# Altium project PCB_IOT_VER.1.PrjPcb
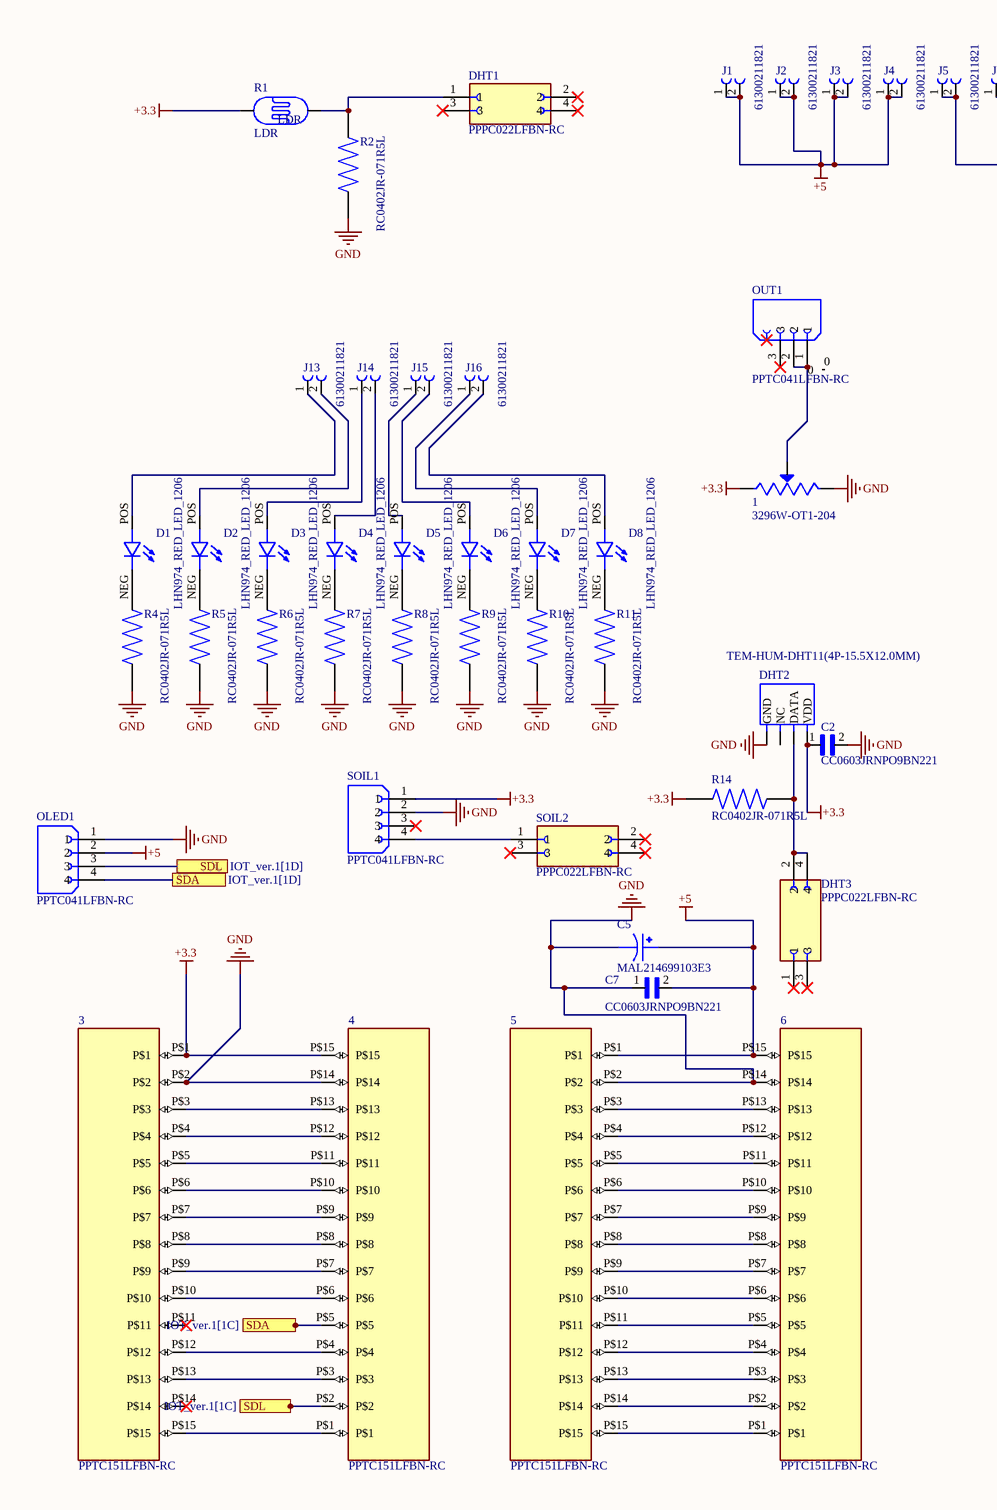
[diagram p0: IOT_ver.1.SchDoc, left]
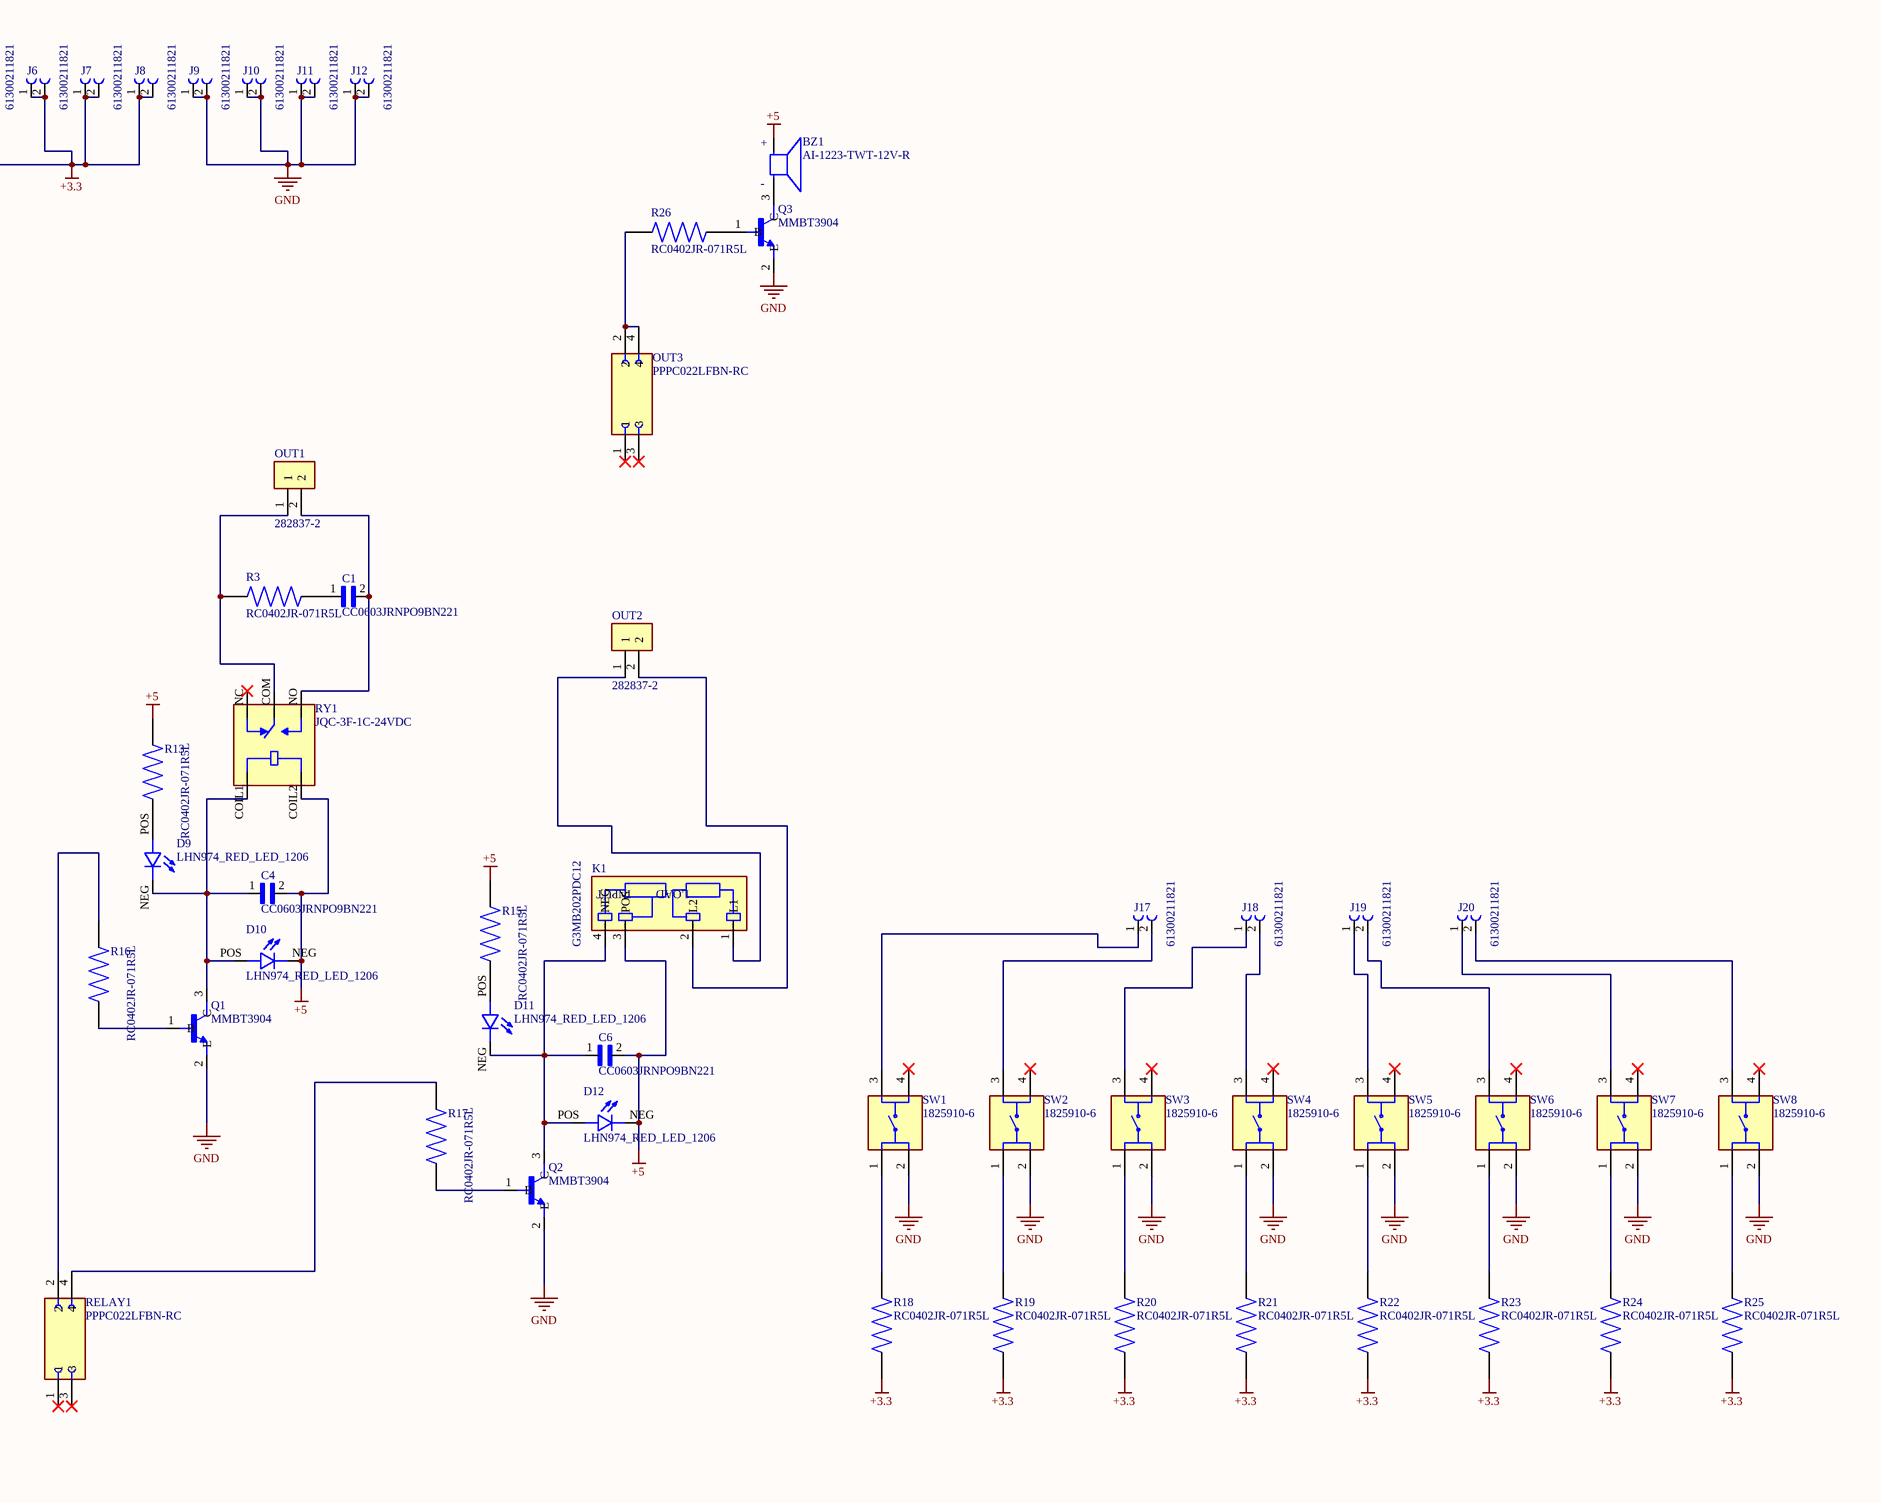
[diagram p1: IOT_ver.1.SchDoc, right]
1 sheet, 93 parts. Net scope: flat (ports and power ports of the same name join across sheets).
Board file: PCB_IOT_VER.1.1.1.PcbDoc

## Sheet IOT_ver.1.SchDoc
size 699 x 299 mm; SheetNumber: 1; SheetTotal: 1

### Parts
(Parts that share a designator on the sheet are numbered #1, #2 ... from top to bottom, then left to right.)
1  3296W-OT1-204  [TRIM_3296W-OT1-204]
3  PPTC151LFBN-RC  [PPTC151LFBN-RC]
4  PPTC151LFBN-RC  [PPTC151LFBN-RC]
5  PPTC151LFBN-RC  [PPTC151LFBN-RC]
6  PPTC151LFBN-RC  [PPTC151LFBN-RC]
BZ1  AI-1223-TWT-12V-R  [XDCR_AI-1223-TWT-12V-R]
C1  CC0603JRNPO9BN221  [C_0.1/250V]
C2  CC0603JRNPO9BN221  [0805-C]
C4  CC0603JRNPO9BN221  [0805-C]
C5  MAL214699103E3  [CAPAE1050X1050N]
C6  CC0603JRNPO9BN221  [0805-C]
C7  CC0603JRNPO9BN221  [0805-C]
D1  LHN974_RED_LED_1206  [LEDC3216X120N]
D2  LHN974_RED_LED_1206  [LEDC3216X120N]
D3  LHN974_RED_LED_1206  [LEDC3216X120N]
D4  LHN974_RED_LED_1206  [LEDC3216X120N]
D5  LHN974_RED_LED_1206  [LEDC3216X120N]
D6  LHN974_RED_LED_1206  [LEDC3216X120N]
D7  LHN974_RED_LED_1206  [LEDC3216X120N]
D8  LHN974_RED_LED_1206  [LEDC3216X120N]
D9  LHN974_RED_LED_1206  [LEDC3216X120N]
D10  LHN974_RED_LED_1206  [LEDC3216X120N]
D11  LHN974_RED_LED_1206  [LEDC3216X120N]
D12  LHN974_RED_LED_1206  [LEDC3216X120N]
DHT1  PPPC022LFBN-RC  [SULLINS_PPPC022LFBN-RC]
DHT2  TEM-HUM-DHT11(4P-15.5X12.0MM)  [SNR4-2.54-15.5X12.0X5.5MM]
DHT3  PPPC022LFBN-RC  [SULLINS_PPPC022LFBN-RC]
J1  61300211821  [61300211821]
J2  61300211821  [61300211821]
J3  61300211821  [61300211821]
J4  61300211821  [61300211821]
J5  61300211821  [61300211821]
J6  61300211821  [61300211821]
J7  61300211821  [61300211821]
J8  61300211821  [61300211821]
J9  61300211821  [61300211821]
J10  61300211821  [61300211821]
J11  61300211821  [61300211821]
J12  61300211821  [61300211821]
J13  61300211821  [61300211821]
J14  61300211821  [61300211821]
J15  61300211821  [61300211821]
J16  61300211821  [61300211821]
J17  61300211821  [61300211821]
J18  61300211821  [61300211821]
J19  61300211821  [61300211821]
J20  61300211821  [61300211821]
K1  G3MB202PDC12  [RELAY_G3MB202PDC12]
OLED1  PPTC041LFBN-RC  [SULLINS_PPTC041LFBN-RC]
OUT1#1  PPTC041LFBN-RC  [SULLINS_PPTC041LFBN-RC]
OUT1#2  282837-2  [TE_282837-2]
OUT2  282837-2  [TE_282837-2]
OUT3  PPPC022LFBN-RC  [SULLINS_PPPC022LFBN-RC]
Q1  MMBT3904  [SOT95P240X120-3N]
Q2  MMBT3904  [SOT95P240X120-3N]
Q3  MMBT3904  [SOT95P240X120-3N]
R1  LDR  [LDR]
R2  RC0402JR-071R5L  [RESC1005X40N]
R3  RC0402JR-071R5L  [2512-R]
R4  RC0402JR-071R5L  [0805-R]
R5  RC0402JR-071R5L  [0805-R]
R6  RC0402JR-071R5L  [0805-R]
R7  RC0402JR-071R5L  [0805-R]
R8  RC0402JR-071R5L  [0805-R]
R9  RC0402JR-071R5L  [0805-R]
R10  RC0402JR-071R5L  [0805-R]
R11  RC0402JR-071R5L  [0805-R]
R13  RC0402JR-071R5L  [0805-R]
R14  RC0402JR-071R5L  [0805-R]
R15  RC0402JR-071R5L  [0805-R]
R16  RC0402JR-071R5L  [0805-R]
R17  RC0402JR-071R5L  [0805-R]
R18  RC0402JR-071R5L  [RESC1005X40N]
R19  RC0402JR-071R5L  [RESC1005X40N]
R20  RC0402JR-071R5L  [RESC1005X40N]
R21  RC0402JR-071R5L  [RESC1005X40N]
R22  RC0402JR-071R5L  [RESC1005X40N]
R23  RC0402JR-071R5L  [RESC1005X40N]
R24  RC0402JR-071R5L  [RESC1005X40N]
R25  RC0402JR-071R5L  [RESC1005X40N]
R26  RC0402JR-071R5L  [0805-R]
RELAY1  PPPC022LFBN-RC  [SULLINS_PPPC022LFBN-RC]
RY1  JQC-3F-1C-24VDC  [RELAY_JQC-3F-1C-24VDC]
SOIL1  PPTC041LFBN-RC  [SULLINS_PPTC041LFBN-RC]
SOIL2  PPPC022LFBN-RC  [SULLINS_PPPC022LFBN-RC]
SW1  1825910-6  [SW_1825910-6-4]
SW2  1825910-6  [SW_1825910-6-4]
SW3  1825910-6  [SW_1825910-6-4]
SW4  1825910-6  [SW_1825910-6-4]
SW5  1825910-6  [SW_1825910-6-4]
SW6  1825910-6  [SW_1825910-6-4]
SW7  1825910-6  [SW_1825910-6-4]
SW8  1825910-6  [SW_1825910-6-4]

### Ports
SDA (see IOT_ver.1[1C]), SDA (see IOT_ver.1[1D]), SDL (see IOT_ver.1[1C]), SDL (see IOT_ver.1[1D])

### Nets
+3.3: 1.1(CCW) 3.P$1 4.P$15 C2.1 DHT2.1(VDD) J5.1 J5.2 J6.1 J6.2 J7.1 J7.2 J8.1 J8.2 R1.1(P$1) R14.2 R18.1 R19.1 R20.1 R21.1 R22.1 R23.1 R24.1 R25.1 SOIL1.1
+5: 5.P$1 6.P$15 BZ1.P(POS) C4.2 C5.1 C6.2 C7.2 D10.NEG D12.NEG J1.1 J1.2 J2.1 J2.2 J3.1 J3.2 J4.1 J4.2 K1.3(POS) OLED1.2 R13.2 R15.2 RY1.COIL2
GND: 1.3(CW) 3.P$2 4.P$14 5.P$2 6.P$14 C2.2 C5.2 C7.1 DHT2.4(GND) J9.1 J9.2 J10.1 J10.2 J11.1 J11.2 J12.1 J12.2 OLED1.1 Q1.2(E) Q2.2(E) Q3.2(E) R2.1 R4.1 R5.1 R6.1 R7.1 R8.1 R9.1 R10.1 R11.1 SOIL1.2 SW1.2 SW2.2 SW3.2 SW4.2 SW5.2 SW6.2 SW7.2 SW8.2
Net1_2: 1.2(WIPER) OUT1#1.1 OUT1#1.2
Net3_P$3: 3.P$3 4.P$13
Net3_P$4: 3.P$4 4.P$12
Net3_P$5: 3.P$5 4.P$11
Net3_P$6: 3.P$6 4.P$10
Net3_P$7: 3.P$7 4.P$9
Net3_P$8: 3.P$8 4.P$8
Net3_P$9: 3.P$9 4.P$7
Net3_P$10: 3.P$10 4.P$6
Net3_P$12: 3.P$12 4.P$4
Net3_P$13: 3.P$13 4.P$3
Net3_P$15: 3.P$15 4.P$1
Net4_P$2: 4.P$2 OLED1.3 ; port SDL
Net4_P$5: 4.P$5 OLED1.4 ; port SDA
Net5_P$3: 5.P$3 6.P$13
Net5_P$4: 5.P$4 6.P$12
Net5_P$5: 5.P$5 6.P$11
Net5_P$6: 5.P$6 6.P$10
Net5_P$7: 5.P$7 6.P$9
Net5_P$8: 5.P$8 6.P$8
Net5_P$9: 5.P$9 6.P$7
Net5_P$10: 5.P$10 6.P$6
Net5_P$11: 5.P$11 6.P$5
Net5_P$12: 5.P$12 6.P$4
Net5_P$13: 5.P$13 6.P$3
Net5_P$14: 5.P$14 6.P$2
Net5_P$15: 5.P$15 6.P$1
NetBZ1_N: BZ1.N(NEG) Q3.3(C)
NetC1_1: C1.1 R3.1
NetC1_2: C1.2 OUT1#2.2 RY1.NO
NetC4_1: C4.1 D9.NEG D10.POS Q1.3(C) RY1.COIL1
NetC6_1: C6.1 D11.NEG D12.POS K1.4(NEG) Q2.3(C)
NetD1_NEG: D1.NEG R4.2
NetD1_POS: D1.POS J13.1
NetD2_NEG: D2.NEG R5.2
NetD2_POS: D2.POS J13.2
NetD3_NEG: D3.NEG R6.2
NetD3_POS: D3.POS J14.1
NetD4_NEG: D4.NEG R7.2
NetD4_POS: D4.POS J14.2
NetD5_NEG: D5.NEG R8.2
NetD5_POS: D5.POS J15.1
NetD6_NEG: D6.NEG R9.2
NetD6_POS: D6.POS J15.2
NetD7_NEG: D7.NEG R10.2
NetD7_POS: D7.POS J16.1
NetD8_NEG: D8.NEG R11.2
NetD8_POS: D8.POS J16.2
NetD9_POS: D9.POS R13.1
NetD11_POS: D11.POS R15.1
NetDHT1_1: DHT1.1 R1.2(P$2) R2.2
NetDHT2_2: DHT2.2(DATA) DHT3.2 DHT3.4 R14.1
NetJ17_1: J17.1 SW1.3
NetJ17_2: J17.2 SW2.3
NetJ18_1: J18.1 SW3.3
NetJ18_2: J18.2 SW4.3
NetJ19_1: J19.1 SW5.3
NetJ19_2: J19.2 SW6.3
NetJ20_1: J20.1 SW7.3
NetJ20_2: J20.2 SW8.3
NetK1_1: K1.1(L1) OUT2.1
NetK1_2: K1.2(L2) OUT2.2
NetOUT1#2_1: OUT1#2.1 R3.2 RY1.COM
NetOUT3_2: OUT3.2 OUT3.4 R26.2
NetQ1_1: Q1.1(B) R16.1
NetQ2_1: Q2.1(B) R17.1
NetQ3_1: Q3.1(B) R26.1
NetR16_2: R16.2 RELAY1.2
NetR17_2: R17.2 RELAY1.4
NetR18_2: R18.2 SW1.1
NetR19_2: R19.2 SW2.1
NetR20_2: R20.2 SW3.1
NetR21_2: R21.2 SW4.1
NetR22_2: R22.2 SW5.1
NetR23_2: R23.2 SW6.1
NetR24_2: R24.2 SW7.1
NetR25_2: R25.2 SW8.1
NetSOIL1_4: SOIL1.4 SOIL2.1

Not connected (* = marked no-connect by the designer): 3 P$11* P$14*; DHT1 2* 3* 4*; DHT2 3(NC); DHT3 1* 3*; OUT1#1 0 3*; OUT3 1* 3*; RELAY1 1* 3*; RY1 NC*; SOIL1 3*; SOIL2 2* 3* 4*; SW1 4*; SW2 4*; SW3 4*; SW4 4*; SW5 4*; SW6 4*; SW7 4*; SW8 4*

### Notes on the sheet
- (in symbol AI-1223-TWT-12V-R) +; -
- (in symbol G3MB202PDC12) INPUT; LOAD

### Library data of the parts
1 = 3296W-OT1-204: Potentiometers, multi, Resistors, trimmer, cermet, potentiometers, turn, sealed, Potentiometers and Accessories, Pass...; MF: Bourns; SnapEDA_Link: https://www.snapeda.com/parts/3296W-OT1-204/Bourns/view-part/?ref=snap; Package: SOT-23-5 Bourns; MP: 3296W-OT1-204; Check_prices: https://www.snapeda.com/parts/3296W-OT1-204/Bourns/view-part/?ref=eda; Price: None; Value: *; Availability: Not in stock
3-6 = PPTC151LFBN-RC: 15 Position Header Connector Through Hole; MF: Sullins Connector; Price: None; Availability: Unavailable; SnapEDA_Link: https://www.snapeda.com/parts/PPTC151LFBN-RC/Sullins%20Connector%20Solutions/view-part/592000/?ref=snap; Value: *; Package: None; MP: PPTC151LFBN-RC
BZ1 = AI-1223-TWT-12V-R: ELECTRO-MECHANICAL AUDIO INDICATOR; MF: PUI Audio,; SnapEDA_Link: https://www.snapeda.com/parts/AI-1223-TWT-12V-R/PUI+Audio%252C+Inc./view-part/?ref=snap; Package: None; MP: AI-1223-TWT-12V-R; Check_prices: https://www.snapeda.com/parts/AI-1223-TWT-12V-R/PUI+Audio%252C+Inc./view-part/?ref=eda; Purchase-URL: https://pricing.snapeda.com/search/part/AI-1223-TWT-12V-R/?ref=eda; Price: None; Value: *; Availability: In Stock
C1 = CC0603JRNPO9BN221: 220 pF Â±5% 50V Ceramic Capacitor C0G, NP0 0603 (1608 Metric); Value: 0.1 uf 250V; MF: Yageo; SnapEDA_Link: https://www.snapeda.com/parts/CC0603JRNPO9BN221/Yageo/view-part/?ref=snap; Purchase-URL: https://pricing.snapeda.com/search/part/CC0603JRNPO9BN221/?ref=eda; Availability: In Stock; Price: None; Package: 0603 Yageo; Check_prices: https://www.snapeda.com/parts/CC0603JRNPO9BN221/Yageo/view-part/?ref=eda; MP: CC0603JRNPO9BN221
C2 C4 C6 = CC0603JRNPO9BN221: 220 pF Â±5% 50V Ceramic Capacitor C0G, NP0 0603 (1608 Metric); Value: 0.1; MF: Yageo; SnapEDA_Link: https://www.snapeda.com/parts/CC0603JRNPO9BN221/Yageo/view-part/?ref=snap; Purchase-URL: https://pricing.snapeda.com/search/part/CC0603JRNPO9BN221/?ref=eda; Availability: In Stock; Price: None; Package: 0603 Yageo; Check_prices: https://www.snapeda.com/parts/CC0603JRNPO9BN221/Yageo/view-part/?ref=eda; MP: CC0603JRNPO9BN221
C5 = MAL214699103E3: 100ÂµF 50V Aluminum Electrolytic Capacitors Radial, Can - SMD 1500 Hrs @ 125Â°C; MF: Vishay BC; Value: 1000uF/16V; MP: MAL214699103E3; SnapEDA_Link: https://www.snapeda.com/parts/MAL214699103E3/Vishay%20BC%20Components/view-part/285948/?ref=snap; Digi-Key_Part_Number: 4437PHCT-ND; Mouser-Purchase-URL: https://snapeda.com/shop?store=Mouser&id=285948; DigiKey-Purchase-URL: https://snapeda.com/shop?store=DigiKey&id=285948; Package: Radial Vishay BC
C7 = CC0603JRNPO9BN221: 220 pF Â±5% 50V Ceramic Capacitor C0G, NP0 0603 (1608 Metric); Value: 0.1uF/16V; MF: Yageo; SnapEDA_Link: https://www.snapeda.com/parts/CC0603JRNPO9BN221/Yageo/view-part/?ref=snap; Purchase-URL: https://pricing.snapeda.com/search/part/CC0603JRNPO9BN221/?ref=eda; Availability: In Stock; Price: None; Package: 0603 Yageo; Check_prices: https://www.snapeda.com/parts/CC0603JRNPO9BN221/Yageo/view-part/?ref=eda; MP: CC0603JRNPO9BN221
D1-D12 = LHN974_RED_LED_1206: 2.6 V Red LED SMD; MP: LHN974 RED LED 1206; MF: Osram; SnapEDA_Link: https://www.snapeda.com/parts/LHN974%20RED%20LED%201206/Osram/view-part/7899607/?ref=snap; Availability: Not in stock; Price: None; Check_prices: https://www.snapeda.com/parts/LHN974%20RED%20LED%201206/Osram/view-part/7899607/?ref=eda; Value: *; Package: None
DHT1 DHT3 OUT3 RELAY1 SOIL2 = PPPC022LFBN-RC: 4 Position Header Connector 0.100 (2.54mm) Through Hole Gold; MF: Sullins Connector Solutions; Check_prices: https://www.snapeda.com/parts/PPPC022LFBN-RC/Sullins+Connector+Solutions/view-part/?ref=eda; Price: None; MP: PPPC022LFBN-RC; SnapEDA_Link: https://www.snapeda.com/parts/PPPC022LFBN-RC/Sullins+Connector+Solutions/view-part/?ref=snap; Availability: In Stock; Value: *; Purchase-URL: https://pricing.snapeda.com/search/part/PPPC022LFBN-RC/?ref=eda; Package: None
DHT2 = TEM-HUM-DHT11(4P-15.5X12.0MM): Servo AC 100 ~ 120VAC Supply 10A 120V Load; MP: DHT11; MF: Panasonic Industrial Automation Sales; Package: None; SnapEDA_Link: https://www.snapeda.com/parts/DHT11/Panasonic/view-part/6618018/?ref=snap; Check_prices: https://www.snapeda.com/parts/DHT11/Panasonic/view-part/6618018/?ref=eda; Availability: In Stock; Value: *; Price: None; Purchase-URL: https://pricing.snapeda.com/search/part/DHT11/?ref=eda
J1-J20 = 61300211821: Female header [WÃ¼rth Elektronik] 61300211821 Female header; MP: 61300211821; SnapEDA_Link: https://www.snapeda.com/parts/61300211821/W%C3%BCrth%20Elektronik/view-part/1736853/?ref=snap; Availability: Unavailable; Package: None; MF: WÃ¼rth Elektronik; Value: *; Price: None
K1 = G3MB202PDC12: Solid State SPST-NO (1 Form A) 4-SIP; MF: Omron Automation; MP: G3MB-202P-DC12; Value: *; Check_prices: https://www.snapeda.com/parts/G3MB-202P-DC12/Omron+Automation+and+Safety/view-part/?ref=eda; Price: None; SnapEDA_Link: https://www.snapeda.com/parts/G3MB-202P-DC12/Omron+Automation+and+Safety/view-part/?ref=snap; Availability: Not in stock; Package: None
OLED1 OUT1#1 SOIL1 = PPTC041LFBN-RC: 4 Position Header Connector 0.100 (2.54mm) Through Hole Tin; MF: Sullins Connector; Purchase-URL: https://pricing.snapeda.com/search/part/PPTC041LFBN-RC/?ref=eda; Check_prices: https://www.snapeda.com/parts/PPTC041LFBN-RC/Sullins+Connector+Solutions/view-part/?ref=eda; Package: None; SnapEDA_Link: https://www.snapeda.com/parts/PPTC041LFBN-RC/Sullins+Connector+Solutions/view-part/?ref=snap; Value: *; MP: PPTC041LFBN-RC; Digi-Key_Part_Number: S7002-ND
OUT1#2 OUT2 = 282837-2: Connector Terminal Blocks Receptacle 2 Position 5.08mm Solder Straight Thru-Hole 13.5A/Contact; MF: TE Connectivity; Check_prices: https://www.snapeda.com/parts/282837-2/TE+Connectivity+AMP+Connectors/view-part/?ref=eda; Value: *; Availability: In Stock; MP: 282837-2; Price: None; Package: None; SnapEDA_Link: https://www.snapeda.com/parts/282837-2/TE+Connectivity+AMP+Connectors/view-part/?ref=snap; Purchase-URL: https://pricing.snapeda.com/search/part/282837-2/?ref=eda
Q1-Q3 = MMBT3904: Bipolar _BJT_ Transistor NPN 40V 200mA 270MHz 350mW Surface Mount SOT-23-3; MF: STMicroelectronics; Price: None; Package: SOT-23-3 Taiwan Semiconductor; Value: *; MP: MMBT3904; Availability: Unavailable; SnapEDA_Link: https://www.snapeda.com/parts/MMBT3904/STMicroelectronics/view-part/2875870/?ref=snap
R1 = LDR: MF: Fairway Electronics; Value: *; Check_prices: https://www.snapeda.com/parts/LDR/Applied+Avionics/view-part/?ref=eda; Price: None; Package: None; SnapEDA_Link: https://www.snapeda.com/parts/LDR/Applied+Avionics/view-part/?ref=snap; Availability: In Stock; MP: LDR
R2 = RC0402JR-071R5L: 1.5 Ohms Â±5% 0.063W, 1/16W Chip Resistor 0402 (1005 Metric) Moisture Resistant Thick Film; Value: 10k; MF: Yageo; Check_prices: https://www.snapeda.com/parts/RC0402JR-071R5L/Yageo/view-part/?ref=eda; Availability: In Stock; MP: RC0402JR-071R5L; Price: None; Package: 1005 Panasonic Electronic Components; SnapEDA_Link: https://www.snapeda.com/parts/RC0402JR-071R5L/Yageo/view-part/?ref=snap; Purchase-URL: https://pricing.snapeda.com/search/part/RC0402JR-071R5L/?ref=eda
R3 = RC0402JR-071R5L: 1.5 Ohms Â±5% 0.063W, 1/16W Chip Resistor 0402 (1005 Metric) Moisture Resistant Thick Film; Value: 100; MF: Yageo; Check_prices: https://www.snapeda.com/parts/RC0402JR-071R5L/Yageo/view-part/?ref=eda; Availability: In Stock; MP: RC0402JR-071R5L; Price: None; Package: 1005 Panasonic Electronic Components; SnapEDA_Link: https://www.snapeda.com/parts/RC0402JR-071R5L/Yageo/view-part/?ref=snap; Purchase-URL: https://pricing.snapeda.com/search/part/RC0402JR-071R5L/?ref=eda
R4-R11 R13-R15 R18-R25 = RC0402JR-071R5L: 1.5 Ohms Â±5% 0.063W, 1/16W Chip Resistor 0402 (1005 Metric) Moisture Resistant Thick Film; Value: 1k; MF: Yageo; Check_prices: https://www.snapeda.com/parts/RC0402JR-071R5L/Yageo/view-part/?ref=eda; Availability: In Stock; MP: RC0402JR-071R5L; Price: None; Package: 1005 Panasonic Electronic Components; SnapEDA_Link: https://www.snapeda.com/parts/RC0402JR-071R5L/Yageo/view-part/?ref=snap; Purchase-URL: https://pricing.snapeda.com/search/part/RC0402JR-071R5L/?ref=eda
R16 R17 R26 = RC0402JR-071R5L: 1.5 Ohms Â±5% 0.063W, 1/16W Chip Resistor 0402 (1005 Metric) Moisture Resistant Thick Film; Value: 3.3k; MF: Yageo; Check_prices: https://www.snapeda.com/parts/RC0402JR-071R5L/Yageo/view-part/?ref=eda; Availability: In Stock; MP: RC0402JR-071R5L; Price: None; Package: 1005 Panasonic Electronic Components; SnapEDA_Link: https://www.snapeda.com/parts/RC0402JR-071R5L/Yageo/view-part/?ref=snap; Purchase-URL: https://pricing.snapeda.com/search/part/RC0402JR-071R5L/?ref=eda
RY1 = JQC-3F-1C-24VDC: Miniature PCB Relay 24VDC, 10A 250VAC, 15A 125VAC, 10A 250VAC; Price: None; Availability: Unavailable; MP: JQC-3F-1C-24VDC; Value: *; Package: None
SW1-SW8 = 1825910-6: Switch Tactile OFF (ON) SPST Round Button PC Pins 0.05A 24VDC 100000Cycles 1.57N Thru-Hole Loose; Price: None; MP: 1825910-6; Availability: Unavailable; Value: *; Package: None